# Altium project bldc-robot-main-board.PrjPcb
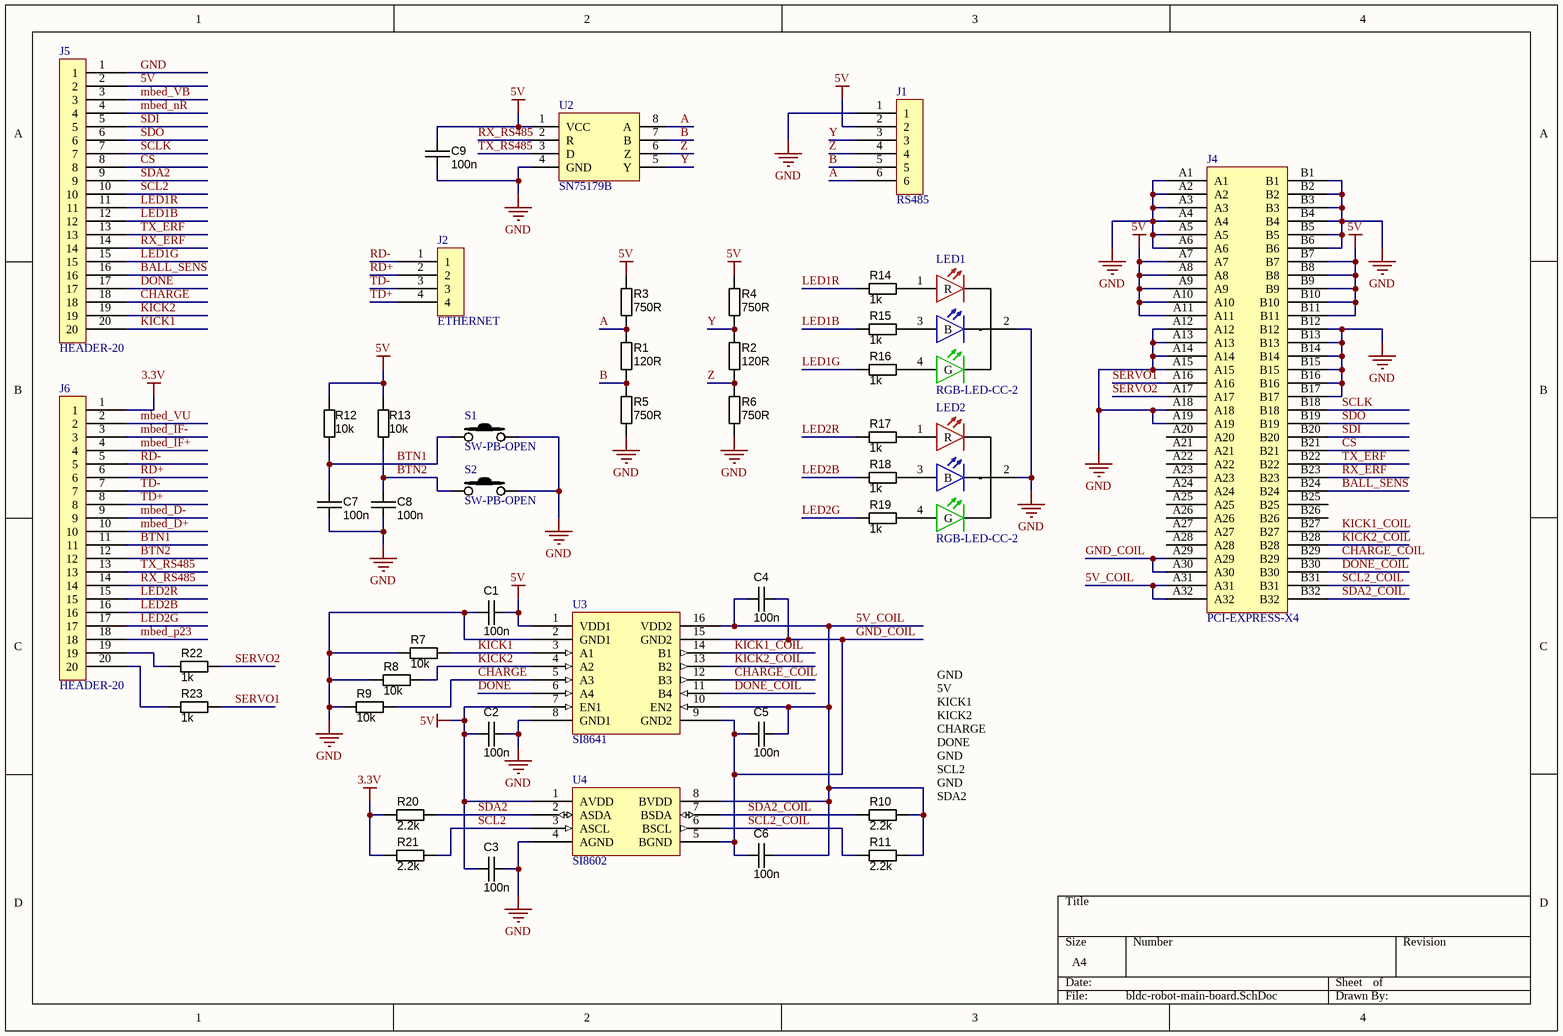
[diagram p0: bldc-robot-main-board.SchDoc]
1 sheet, 44 parts. Net scope: global (net labels, ports and power ports of the same name join across sheets).
Board file: bldc-robot-main-board.PcbDoc

## Sheet bldc-robot-main-board.SchDoc
size A4

### Parts
C1  100n  [CAPC1608X90N]
C2  100n  [CAPC1608X90N]
C3  100n  [CAPC1608X90N]
C4  100n  [CAPC1608X90N]
C5  100n  [CAPC1608X90N]
C6  100n  [CAPC1608X90N]
C7  100n  [CAPC1608X90N]
C8  100n  [CAPC1608X90N]
C9  100n  [CAPC1608X90N]
J1  RS485  [MICRO-MATCH-6]
J2  ETHERNET  [MICRO-MATCH-4]
J4  PCI-EXPRESS-X4  [PCI-EXPRESS-X4-CARD-EDGE]
J5  HEADER-20  [MICRO-MATCH-20]
J6  HEADER-20  [MICRO-MATCH-20]
LED1  RGB-LED-CC-2  [RGB-LED-5mm]
LED2  RGB-LED-CC-2  [RGB-LED-5mm]
R1  120R  [RESC1608X55N]
R2  120R  [RESC1608X55N]
R3  750R  [RESC1608X55N]
R4  750R  [RESC1608X55N]
R5  750R  [RESC1608X55N]
R6  750R  [RESC1608X55N]
R7  10k  [RESC1608X55N]
R8  10k  [RESC1608X55N]
R9  10k  [RESC1608X55N]
R10  2.2k  [RESC1608X55N]
R11  2.2k  [RESC1608X55N]
R12  10k  [RESC1608X55N]
R13  10k  [RESC1608X55N]
R14  1k  [RESC1608X55N]
R15  1k  [RESC1608X55N]
R16  1k  [RESC1608X55N]
R17  1k  [RESC1608X55N]
R18  1k  [RESC1608X55N]
R19  1k  [RESC1608X55N]
R20  2.2k  [RESC1608X55N]
R21  2.2k  [RESC1608X55N]
R22  1k  [RESC1608X55N]
R23  1k  [RESC1608X55N]
S1  SW-PB-OPEN  [MC8US9R2A2M7RES]
S2  SW-PB-OPEN  [MC8US9R2A2M7RES]
U2  SN75179B  [SOIC-8]
U3  SI8641  [SOIC16]
U4  SI8602  [SOIC8]

### Nets
3.3V: J6.1 R20.1 R21.1
5V: C1.1 C2.2 C3.2 C9.1 J1.2 J4.A7 J4.A8 J4.A9 J4.A10 J4.A11 J4.B7 J4.B8 J4.B9 J4.B10 J4.B11 J5.2 R3.1 R4.1 R12.2 R13.2 U2.1(VCC) U3.1(VDD1) U3.7(EN1) U4.1(AVDD)
GND: C1.2 C2.1 C3.1 C7.2 C8.2 C9.2 J1.1 J4.A1 J4.A2 J4.A3 J4.A4 J4.A5 J4.A6 J4.A12 J4.A13 J4.A14 J4.A15 J4.A18 J4.A19 J4.B1 J4.B2 J4.B3 J4.B4 J4.B5 J4.B6 J4.B12 J4.B13 J4.B14 J4.B15 J4.B16 J4.B17 J5.1 LED1.2(-) LED2.2(-) R5.2 R6.2 R7.1 R8.1 R9.1 S1.2 S2.2 U2.4(GND) U3.2(GND1) U3.8(GND1) U4.4(AGND)
5V_COIL: C4.2 C5.1 C6.1 J4.A31 J4.A32 R10.2 R11.2 U3.10(EN2) U3.16(VDD2) U4.8(BVDD)
A: J1.6 R1.1 R3.2 U2.8(A)
B: J1.5 R1.2 R5.1 U2.7(B)
BALL_SENS: J4.B24 J5.16
BTN1: C7.1 J6.11 R12.1 S1.1
BTN2: C8.1 J6.12 R13.1 S2.1
CHARGE: J5.18 R9.2 U3.5(A3)
CHARGE_COIL: J4.B29 U3.12(B3)
CS: J4.B21 J5.8
DONE: J5.17 U3.6(A4)
DONE_COIL: J4.B30 U3.11(B4)
GND_COIL: C4.1 C5.2 C6.2 J4.A29 J4.A30 U3.9(GND2) U3.15(GND2) U4.5(BGND)
KICK1: J5.20 R7.2 U3.3(A1)
KICK1_COIL: J4.B27 U3.14(B1)
KICK2: J5.19 R8.2 U3.4(A2)
KICK2_COIL: J4.B28 U3.13(B2)
LED1B: J5.12 R15.1
LED1G: J5.15 R16.1
LED1R: J5.11 R14.1
LED2B: J6.16 R18.1
LED2G: J6.17 R19.1
LED2R: J6.15 R17.1
mbed_D+: J6.10
mbed_D-: J6.9
mbed_IF+: J6.4
mbed_IF-: J6.3
mbed_nR: J5.4
mbed_p23: J6.18
mbed_VB: J5.3
mbed_VU: J6.2
RD+: J2.2 J6.6
RD-: J2.1 J6.5
RX_ERF: J4.B23 J5.14
RX_RS485: J6.14 U2.2(R)
SCL2: J5.10 R21.2 U4.3(ASCL)
SCL2_COIL: J4.B31 R11.1 U4.6(BSCL)
SCLK: J4.B18 J5.7
SDA2: J5.9 R20.2 U4.2(ASDA)
SDA2_COIL: J4.B32 R10.1 U4.7(BSDA)
SDI: J4.B20 J5.5
SDO: J4.B19 J5.6
SERVO1: J4.A16 R23.2
SERVO2: J4.A17 R22.2
TD+: J2.4 J6.8
TD-: J2.3 J6.7
TX_ERF: J4.B22 J5.13
TX_RS485: J6.13 U2.3(D)
Y: J1.3 R2.1 R4.2 U2.5(Y)
Z: J1.4 R2.2 R6.1 U2.6(Z)
NetJ6_19: J6.19 R22.1
NetJ6_20: J6.20 R23.1
NetLED1_1: LED1.1(R) R14.2
NetLED1_3: LED1.3(B) R15.2
NetLED1_4: LED1.4(G) R16.2
NetLED2_1: LED2.1(R) R17.2
NetLED2_3: LED2.3(B) R18.2
NetLED2_4: LED2.4(G) R19.2

Not connected (* = marked no-connect by the designer): J4 A20 A21 A22 A23 A24 A25 A26 A27 A28 B25 B26

### Notes on the sheet
- GND
  5V
  KICK1
  KICK2
  CHARGE
  DONE
  GND
  SCL2
  GND
  SDA2

### Library data of the parts
C1-C9 = CAPC_100n_0603_X7R_50V_10%: Capacitor SMD Cer 100nF 10% 50V X7R 0603; Manufacturer 1: AVX Corporation; Manufacturer Part Number 1: 06035C104KAT2A; Ratings: 50V; X7R; Material: ceramic; SCDType: spec; Manufacturer 2: TDK Corporation; Manufacturer Part Number 2: C1608X7R1H104K; Package / Case: 0603 (1608 Metric); Tolerance: ±10%; Supplier 1: Digi-Key; Supplier Part Number 1: 478-5052-1-ND; ComponentLink1URL: http://www.avx.com/docs/Catalogs/cx7r.pdf; ComponentLink1Description: http://www.avx.com/docs/Catalogs/cx7r.pdf; Supplier 2: Digi-Key; Supplier Part Number 2: 445-1314-1-ND; ComponentLink2URL: http://product.tdk.com/capacitor/mlcc/en/documents/mlcc_commercial_general_en.pdf; ComponentLink2Description: http://product.tdk.com/capacitor/mlcc/en/documents/mlcc_commercial_general_en.pdf; Value: 100n
J1 = HEADER-6
J2 = HEADER-4
R1 R2 = RES_120R_0603_5%: Resistor SMD chip 120 Ohm 0.1W 5% 0603; Manufacturer 1: Vishay Dale; Manufacturer Part Number 1: CRCW0603120RJNEA; Ratings: 1/10 W; SCDType: spec; Package / Case: 0603 (1608 metric); Tolerance: ±5%; Material: Thick Film; Supplier 1: Digi-Key; Supplier Part Number 1: 541-120GCT-ND; ComponentLink1URL: http://www.vishay.com/doc?20035; ComponentLink1Description: http://www.vishay.com/doc?20035; Supplier 2: Digi-Key; Supplier Part Number 2: 311-120GRCT-ND; Manufacturer 2: Yageo; Manufacturer Part Number 2: RC0603JR-07120RL; ComponentLink2URL: http://www.yageo.com/documents/recent/PYu-RC0603_51_RoHS_L_4.pdf; ComponentLink2Description: http://www.yageo.com/documents/recent/PYu-RC0603_51_RoHS_L_4.pdf; Value: 120R
R3-R23 = RES_120R_0603_5%: Resistor SMD chip 120 Ohm 0.1W 5% 0603; Manufacturer 1: Vishay Dale; Manufacturer Part Number 1: CRCW0603120RJNEA; Ratings: 1/10 W; SCDType: spec; Value: 120R; Package / Case: 0603 (1608 metric); Tolerance: ±5%; Material: Thick Film; Supplier 1: Digi-Key; Supplier Part Number 1: 541-120GCT-ND; ComponentLink1URL: http://www.vishay.com/doc?20035; ComponentLink1Description: http://www.vishay.com/doc?20035; Supplier 2: Digi-Key; Supplier Part Number 2: 311-120GRCT-ND; Manufacturer 2: Yageo; Manufacturer Part Number 2: RC0603JR-07120RL; ComponentLink2URL: http://www.yageo.com/documents/recent/PYu-RC0603_51_RoHS_L_4.pdf; ComponentLink2Description: http://www.yageo.com/documents/recent/PYu-RC0603_51_RoHS_L_4.pdf
S1 S2 = SW-PB-OPEN: pin to pad: 1>4 2>6